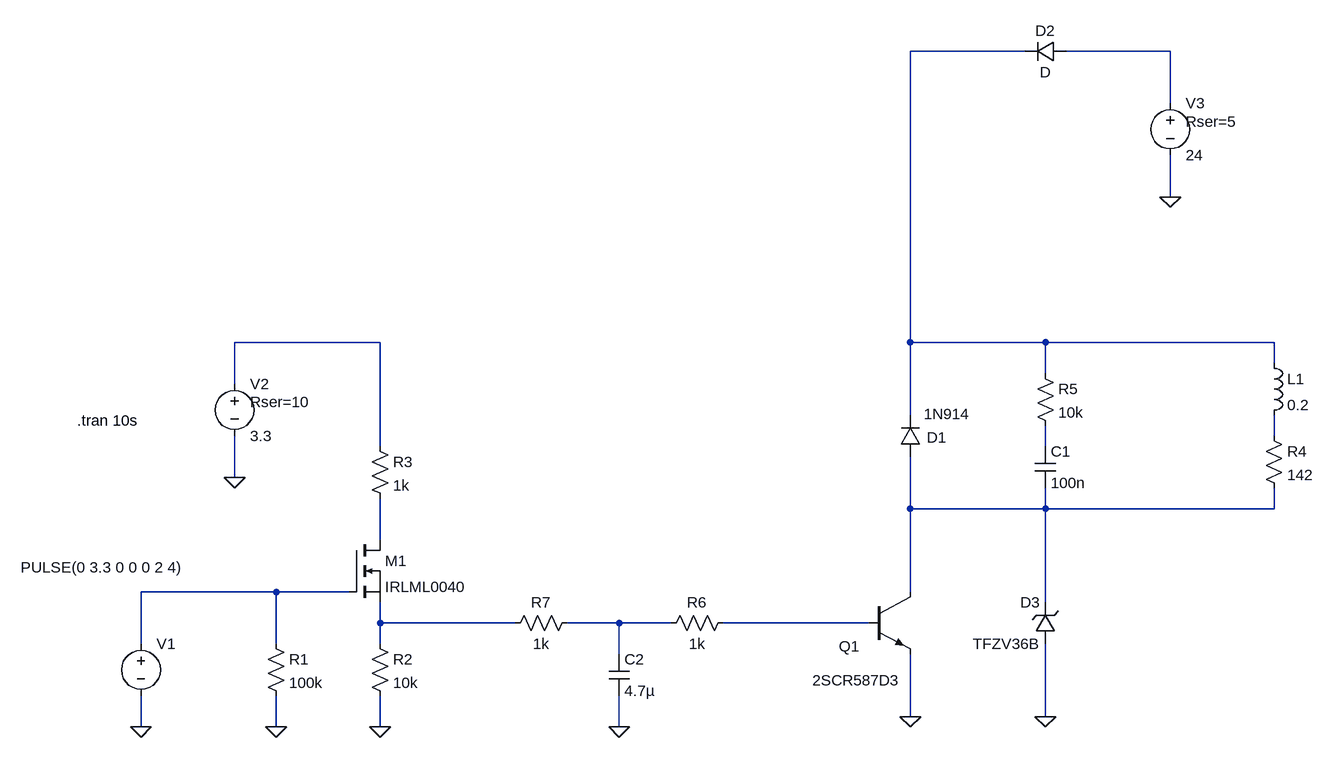
[diagram p0: schematic InductiveLoadSwitch.asc]
InductiveLoadSwitch.asc, the LTspice schematic file:
Version 4
SHEET 1 1968 680
WIRE 1216 -752 1040 -752
WIRE 1440 -752 1280 -752
WIRE 1440 -672 1440 -752
WIRE 1440 -528 1440 -592
WIRE 224 -304 0 -304
WIRE 1040 -304 1040 -752
WIRE 1248 -304 1040 -304
WIRE 1600 -304 1248 -304
WIRE 1600 -272 1600 -304
WIRE 1248 -256 1248 -304
WIRE 0 -240 0 -304
WIRE 1040 -192 1040 -304
WIRE 1600 -160 1600 -192
WIRE 224 -144 224 -304
WIRE 1248 -144 1248 -176
WIRE 0 -96 0 -160
WIRE 1040 -48 1040 -128
WIRE 1248 -48 1248 -80
WIRE 1248 -48 1040 -48
WIRE 1600 -48 1600 -80
WIRE 1600 -48 1248 -48
WIRE 224 0 224 -64
WIRE 64 80 -144 80
WIRE 176 80 64 80
WIRE 1040 80 1040 -48
WIRE 1248 96 1248 -48
WIRE 224 128 224 96
WIRE 432 128 224 128
WIRE 592 128 512 128
WIRE 672 128 592 128
WIRE 976 128 752 128
WIRE -144 160 -144 80
WIRE 64 160 64 80
WIRE 224 160 224 128
WIRE 592 176 592 128
WIRE 1040 272 1040 176
WIRE 1248 272 1248 160
WIRE -144 288 -144 240
WIRE 64 288 64 240
WIRE 224 288 224 240
WIRE 592 288 592 240
FLAG -144 288 0
FLAG 64 288 0
FLAG 224 288 0
FLAG 1040 272 0
FLAG 1440 -528 0
FLAG 0 -96 0
FLAG 1248 272 0
FLAG 592 288 0
SYMBOL res 48 144 R0
SYMATTR InstName R1
SYMATTR Value 100k
SYMBOL res 208 144 R0
SYMATTR InstName R2
SYMATTR Value 10k
SYMBOL res 208 -160 R0
SYMATTR InstName R3
SYMATTR Value 1k
SYMBOL nmos 176 0 R0
SYMATTR InstName M1
SYMATTR Value IRLML0040
SYMBOL npn 976 80 R0
WINDOW 0 -46 84 Left 2
WINDOW 3 -87 136 Left 2
SYMATTR InstName Q1
SYMATTR Value 2SCR587D3
SYMBOL diode 1056 -128 R180
WINDOW 0 -40 30 Left 2
WINDOW 3 -76 66 Left 2
SYMATTR InstName D1
SYMATTR Value 1N914
SYMBOL ind 1584 -288 R0
SYMATTR InstName L1
SYMATTR Value 0.2
SYMBOL res 1584 -176 R0
SYMATTR InstName R4
SYMATTR Value 142
SYMBOL voltage -144 144 R0
WINDOW 3 -185 -102 Left 2
WINDOW 123 0 0 Left 0
WINDOW 39 0 0 Left 0
SYMATTR InstName V1
SYMATTR Value PULSE(0 3.3 0 0 0 2 4)
SYMBOL voltage 0 -256 R0
WINDOW 123 0 0 Left 0
WINDOW 39 24 44 Left 2
SYMATTR InstName V2
SYMATTR Value 3.3
SYMATTR SpiceLine Rser=10
SYMBOL voltage 1440 -688 R0
WINDOW 123 0 0 Left 0
WINDOW 39 24 44 Left 2
SYMATTR InstName V3
SYMATTR Value 24
SYMATTR SpiceLine Rser=5
SYMBOL cap 1232 -144 R0
SYMATTR InstName C1
SYMATTR Value 100n
SYMBOL res 1232 -272 R0
SYMATTR InstName R5
SYMATTR Value 10k
SYMBOL diode 1280 -768 R90
WINDOW 0 0 32 VBottom 2
WINDOW 3 32 32 VTop 2
SYMATTR InstName D2
SYMBOL zener 1264 160 R180
WINDOW 0 24 64 Left 2
WINDOW 3 24 0 Left 2
SYMATTR InstName D3
SYMATTR Value TFZV36B
SYMBOL res 768 112 R90
WINDOW 0 0 56 VBottom 2
WINDOW 3 32 56 VTop 2
SYMATTR InstName R6
SYMATTR Value 1k
SYMBOL cap 576 176 R0
SYMATTR InstName C2
SYMATTR Value 4.7µ
SYMBOL res 528 112 R90
WINDOW 0 0 56 VBottom 2
WINDOW 3 32 56 VTop 2
SYMATTR InstName R7
SYMATTR Value 1k
TEXT -242 -184 Left 2 !.tran 10s

The netlist it stands for:
* InductiveLoadSwitch.asc
R1 N008 0 100k
R2 N009 0 10k
R3 N003 N007 1k
M1 N007 N008 N009 N009 IRLML0040
Q1 N006 N011 0 0 2SCR587D3
D1 N006 N001 1N914
L1 N001 N004 0.2
R4 N004 N006 142
V1 N008 0 PULSE(0 3.3 0 0 0 2 4)
V2 N003 0 3.3 Rser=10
V3 N002 0 24 Rser=5
C1 N005 N006 100n
R5 N001 N005 10k
D2 N002 N001 D
D3 0 N006 TFZV36B
R6 N011 N010 1k
C2 N010 0 4.7µ
R7 N010 N009 1k
.model D D
.lib standard.dio
.model NPN NPN
.model PNP PNP
.lib standard.bjt
.model NMOS NMOS
.model PMOS PMOS
.lib standard.mos
.tran 10s
.backanno
.end